# Altium schematic sheet RS485.SchDoc
size A4; SheetNumber: 9; SheetTotal: 12
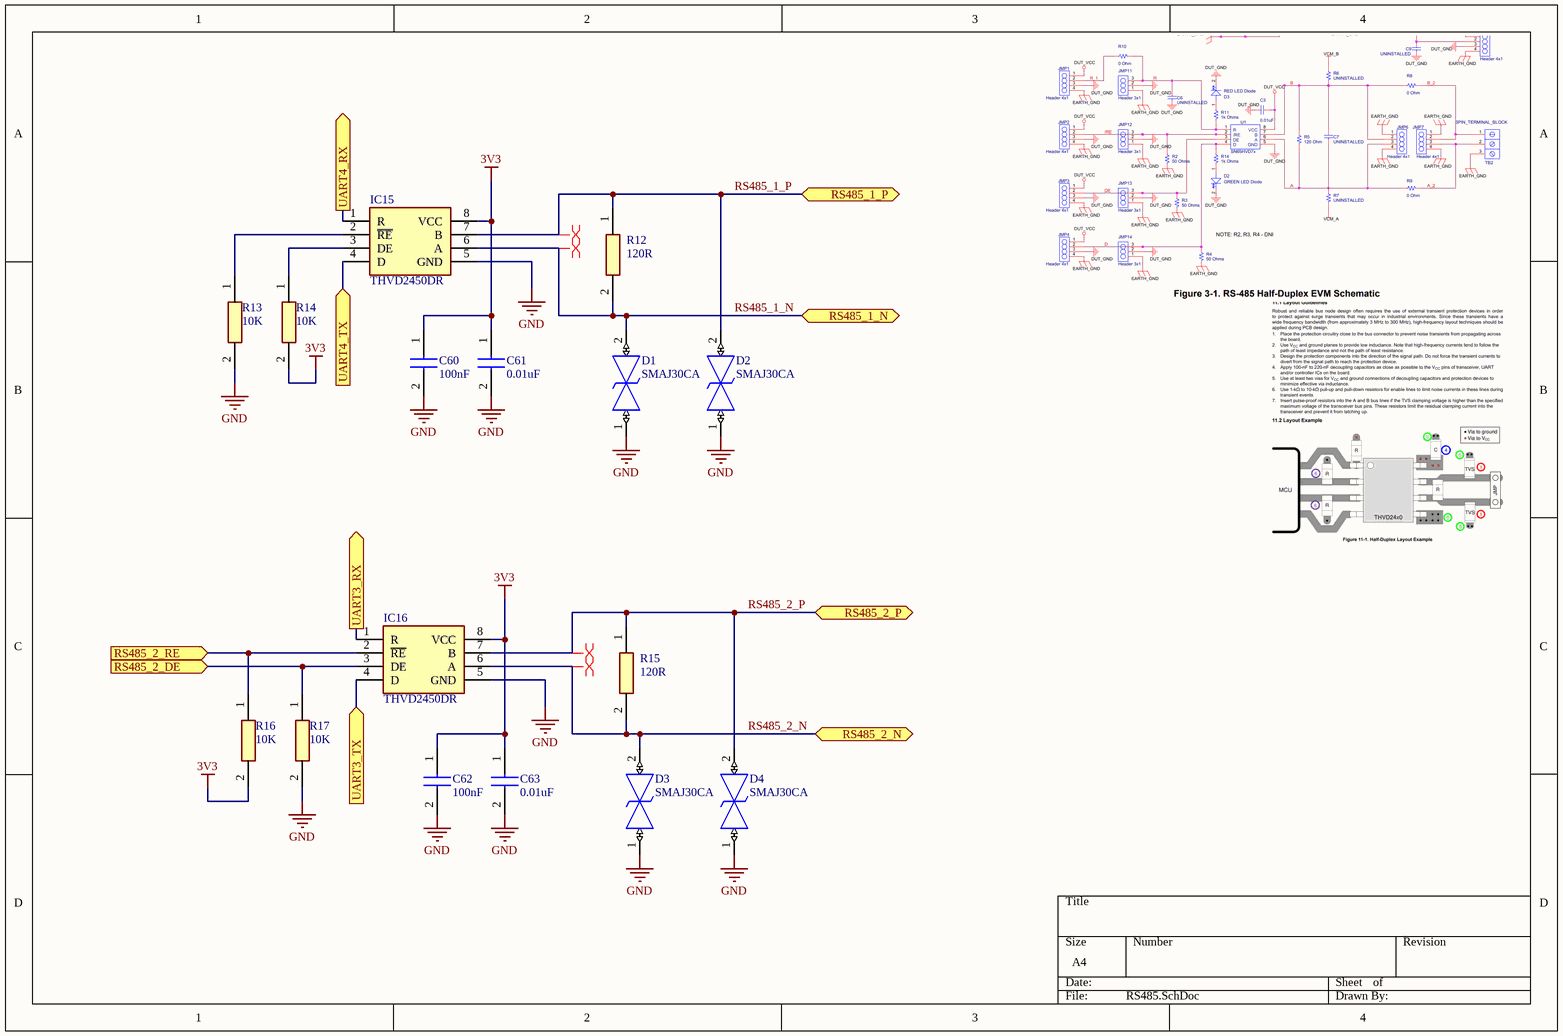
[diagram p0: RS485.SchDoc]

## Parts
C60  100nF  [CAPC1608X95N]
C61  0.01uF  [C0603]
C62  100nF  [CAPC1608X95N]
C63  0.01uF  [C0603]
D1  SMAJ30CA  [DIONM5026X229N]
D2  SMAJ30CA  [DIONM5026X229N]
D3  SMAJ30CA  [DIONM5026X229N]
D4  SMAJ30CA  [DIONM5026X229N]
IC15  THVD2450DR  [SOIC127P600X175-8N]
IC16  THVD2450DR  [SOIC127P600X175-8N]
R12  120R  [ERA6VK]
R13  10K  [RESC1508X50N]
R14  10K  [RESC1508X50N]
R15  120R  [ERA6VK]
R16  10K  [RESC1508X50N]
R17  10K  [RESC1508X50N]

## Ports
RS485_1_N (bidir), RS485_1_P (bidir), RS485_2_DE (in), RS485_2_N (bidir), RS485_2_P (bidir), RS485_2_RE (in), UART3_RX (out), UART3_TX (in), UART4_RX (out), UART4_TX (in)

## Nets
3V3: C60.1 C61.1 C62.1 C63.1 IC15.8(VCC) IC16.8(VCC) R14.2 R16.2
GND: C60.2 C61.2 C62.2 C63.2 D1.1 D2.1 D3.1 D4.1 IC15.5(GND) IC16.5(GND) R13.2 R17.2
RS485_1_N: D1.2 IC15.6(A) R12.2 ; port RS485_1_N
RS485_1_P: D2.2 IC15.7(B) R12.1 ; port RS485_1_P
RS485_2_DE: IC16.3(DE) R17.1 ; port RS485_2_DE
RS485_2_N: D3.2 IC16.6(A) R15.2 ; port RS485_2_N
RS485_2_P: D4.2 IC16.7(B) R15.1 ; port RS485_2_P
RS485_2_RE: IC16.2(~{RE}) R16.1 ; port RS485_2_RE
UART3_RX: IC16.1(R) ; port UART3_RX
UART3_TX: IC16.4(D) ; port UART3_TX
UART4_RX: IC15.1(R) ; port UART4_RX
UART4_TX: IC15.4(D) ; port UART4_TX
NetIC15_2: IC15.2(~{RE}) R13.1
NetIC15_3: IC15.3(DE) R14.1

## Layout directives
differential pair: RS485_1_N, RS485_1_P, RS485_2_N, RS485_2_P

## Library data of the parts
C60 C62 = C0603C104M4RAC7867: 0.1 µF ±20% 16V Ceramic Capacitor X7R 0603 (1608 Metric); Manufacturer_Name: KEMET; Datasheet Link: https://www.arrow.com/en/products/c0603c104m4rac7867/kemet-corporation?region=nac; Height: 0.95mm; Manufacturer_Part_Number: C0603C104M4RAC7867; Mouser Part Number: N/A; Mouser Price/Stock: https://www.mouser.co.uk/ProductDetail/KEMET/C0603C104M4RAC7867?qs=nAEW9fCjKd%252BI998RVtZhZQ%3D%3D; Arrow Part Number: C0603C104M4RAC7867; Arrow Price/Stock: https://www.arrow.com/en/products/c0603c104m4rac7867/kemet-corporation?region=europe
C61 C63 = C0603C103KMRECAUTO: 10000 pF ±10% 63V Ceramic Capacitor X7R 0603 (1608 Metric); Manufacturer_Name: KEMET; Datasheet Link: https://content.kemet.com/datasheets/KEM_C1090_X7R_ESD.pdf; Height: 0.87mm; Manufacturer_Part_Number: C0603C103KMRECAUTO; Mouser Part Number: 80-C0603C103KMREAUTO; Mouser Price/Stock: https://www.mouser.co.uk/ProductDetail/KEMET/C0603C103KMRECAUTO?qs=u4fy%2FsgLU9P0r6p3bzZgfw%3D%3D; Arrow Part Number: C0603C103KMRECAUTO; Arrow Price/Stock: https://www.arrow.com/en/products/c0603c103kmrecauto/kemet-corporation?region=nac
D1-D4 = SMAJ30CA: 48.4V Clamp 8.3A Ipp Tvs Diode Surface Mount DO-214AC (SMA); Manufacturer_Name: LITTELFUSE; Datasheet Link: https://www.mouser.se/datasheet/2/240/Littelfuse_TVS_Diode_SMAJ_Datasheet.pdf-540740.pdf; Height: 2.29mm; Manufacturer_Part_Number: SMAJ30CA; Mouser Part Number: 576-SMAJ30CA; Mouser Price/Stock: https://www.mouser.co.uk/ProductDetail/Littelfuse/SMAJ30CA?qs=HR2RnyOI4E7JQai5qAA1IA%3D%3D; Arrow Part Number: SMAJ30CA; Arrow Price/Stock: https://www.arrow.com/en/products/smaj30ca/littelfuse?region=nac
IC15 IC16 = THVD2450DR: 1/1 Transceiver Half RS485 8-SOIC; Manufacturer_Name: Texas Instruments; Datasheet Link: http://www.ti.com/lit/gpn/THVD2450; Height: 1.75mm; Manufacturer_Part_Number: THVD2450DR; Mouser Part Number: 595-THVD2450DR; Mouser Price/Stock: https://www.mouser.co.uk/ProductDetail/Texas-Instruments/THVD2450DR?qs=%252B6g0mu59x7KnRZ8zf%2FOjqQ%3D%3D; Arrow Part Number: THVD2450DR; Arrow Price/Stock: https://www.arrow.com/en/products/thvd2450dr/texas-instruments?region=nac
R12 R15 = ERA-6VEB1200V: 120 Ohms ±0.1% 0.25W, 1/4W Chip Resistor 0805 (2012 Metric) Anti-Sulfur, Automotive AEC-Q200 Thin Film; Manufacturer_Name: Panasonic; Datasheet Link: http://industrial.panasonic.com/cdbs/www-data/pdf/RDM0000/RDM0000C331.pdf; Height: 0.65mm; Manufacturer_Part_Number: ERA-6VEB1200V; Mouser Part Number: 667-ERA-6VEB1200V; Mouser Price/Stock: https://www.mouser.co.uk/ProductDetail/Panasonic/ERA-6VEB1200V?qs=rI7uf1IzohQDwVDMjI%252BQDA%3D%3D; Arrow Part Number: ERA-6VEB1200V; Arrow Price/Stock: https://www.arrow.com/en/products/era-6veb1200v/panasonic?region=nac
R13 R14 R16 R17 = RNCP0603FTD10K0: 10 kOhms ±1% 0.125W, 1/8W Chip Resistor 0603 (1608 Metric) Anti-Sulfur Thin Film; Manufacturer_Name: Stackpole Electronics; Datasheet Link: https://cs.seielect.com/catalog/SEI-RNCP.pdf; Height: 0.5mm; Manufacturer_Part_Number: RNCP0603FTD10K0; Mouser Part Number: 708-RNCP0603FTD10K0; Mouser Price/Stock: https://www.mouser.co.uk/ProductDetail/SEI-Stackpole/RNCP0603FTD10K0?qs=FESYatJ8odL1jmHQSpKOPg%3D%3D; Arrow Part Number: RNCP0603FTD10K0; Arrow Price/Stock: https://www.arrow.com/en/products/rncp0603ftd10k0/stackpole-electronics?region=nac